# EAGLE board sha2017_rev0_1_0_dev (EAGLE 6.6.0)
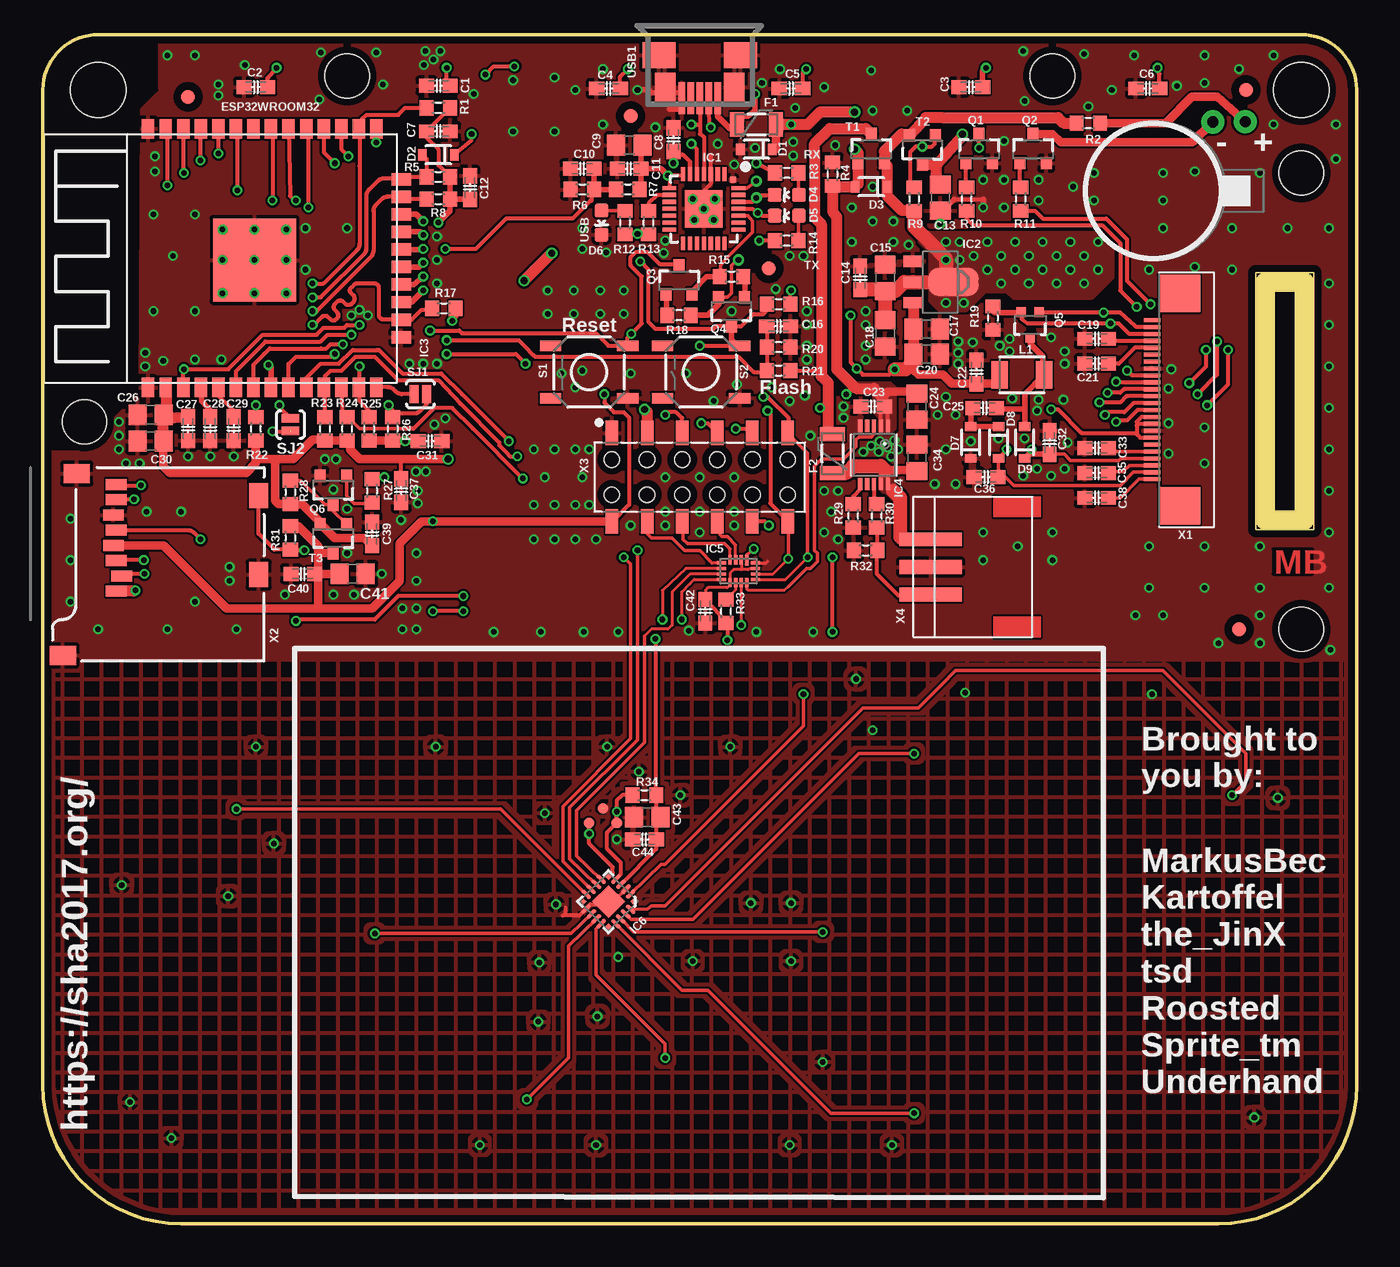
[diagram p5: board, top side]
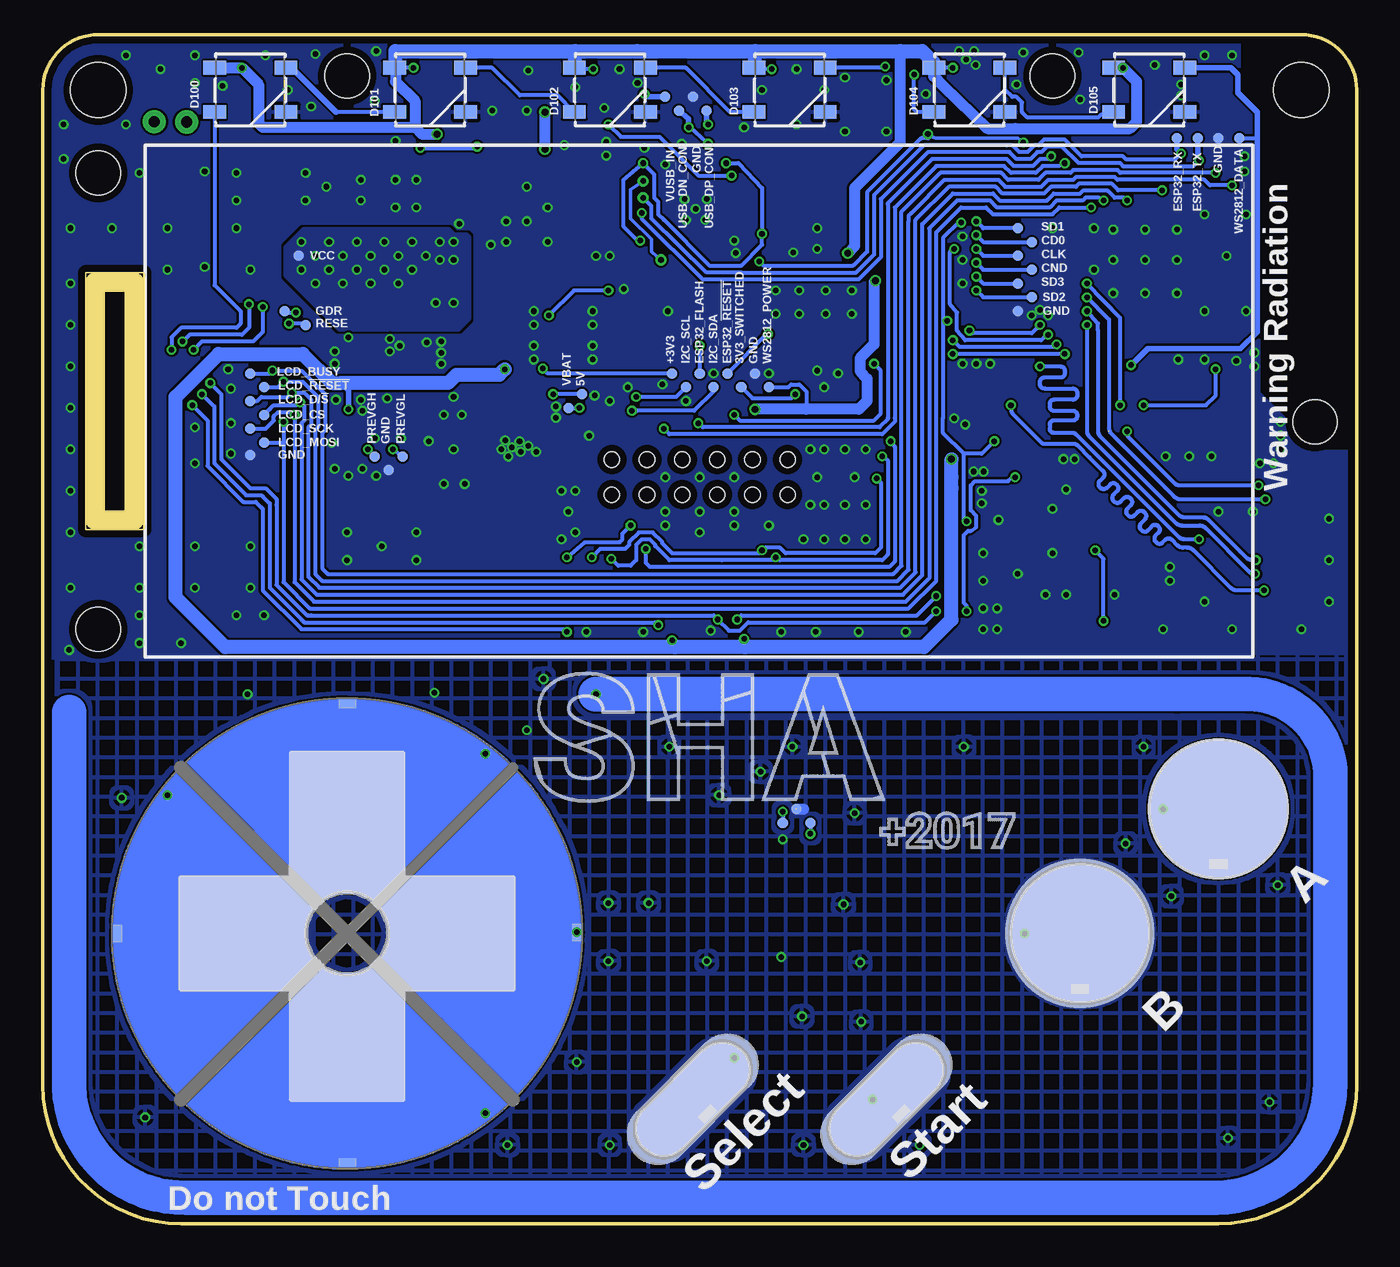
[diagram p6: board, bottom side, seen from below]

Size 95 x 86 mm. Coordinates in mm from the lower left corner, seen from the top.
Outline: 87.7,67.6 87.7,68.8
Outline: 87.7,68.8 91.9,68.8 91.9,50.2 87.7,50.2 87.7,68.8
Outline: 91,86 4,86 arc90 0,82 0,10 arc90 10,0 85,0 arc90 95,10 95,82 arc90 91,86
Copper layers (1*16): Top 0.035mm / dielectric 1.6mm / Bottom 0.035mm
Design rules "Elecrow_2-layer_PCB_eagle_rule *": minimum track width 6mil, minimum drill 12mil, track to track 6mil, track to pad 6mil, pad to pad 6mil, via to via 8mil, smd to smd 0mil, copper to edge 20mil, drill to drill 10mil, minimum pad ring 6mil, minimum via ring 6mil, stop-mask expansion 0mil, vias tented up to drill 100mil, thermal gap 10mil
Net classes: 1 FAT: width 0.2 mm, drill 0.4 mm; 2 GND/3V3: width 0.2 mm, drill 0.4 mm; 3 Touch: width 0.2 mm, clearance 1 mm; 4 touch prox: width 0.2 mm, clearance 1.6 mm
Holes 4 mm at 91,82 4,82
Holes 3.2 mm at 3,58 91,43 91,76 22,83 73,83
tRestrict: area -0.3,56.1 to 8.2,86.1
bRestrict: area -0.3,56.1 to 8.2,86.1
Milling: 4 lines

## Footprints (pad centres in the part's own frame; a part is rotated, then mirrored left to right if it is on the bottom)
VIA = drill 0.4 pad 0.705: P$1 0,0
C0603-DASHES = smd 1.1 x 1: 1 -0.85,0; 2 0.85,0
C0805 = smd 1.3 x 1.5: 1 -0.95,0; 2 0.95,0
SOD-323 = smd 0.63 x 0.83: A 1.15,0; C -1.15,0
LED-0603 = smd 1 x 1: A 0,-0.877; C 0,0.877
WS2812B = smd 1.651 x 1: 1 -2.577,1.6; 2 -2.577,-1.6; 3 2.577,-1.6; 4 2.577,1.6
PTC-1206 = smd 1 x 1.8: 1 -1.4,0; 2 1.4,0
FIDUCIAL_1MM = smd 1 x 1: 1 0,0
MLP28 = smd 1 x 0.3: 1 -2.5,1.5; 2 -2.5,1; 3 -2.5,0.5; 4 -2.5,0; 5 -2.5,-0.5; 6 -2.5,-1; 7 -2.5,-1.5; 15 2.5,-1.5; 16 2.5,-1; 17 2.5,-0.5; 18 2.5,0; 19 2.5,0.5; 20 2.5,1; 21 2.5,1.5 | smd 0.3 x 1: 8 -1.5,-2.5; 9 -1,-2.5; 10 -0.5,-2.5; 11 0,-2.5; 12 0.5,-2.5; 13 1,-2.5; 14 1.5,-2.5; 22 1.5,2.5; 23 1,2.5; 24 0.5,2.5; 25 0,2.5; 26 -0.5,2.5; 27 -1,2.5; 28 -1.5,2.5 | smd 2.7 x 2.7: EXP 0,0 | smd 0.435 x 0.435: M -2.103,2.103
SOT89 = smd 0.8 x 1.4: 1 -1.499,-1.981; 3 1.499,-1.981 | smd 0.813 x 1.397: 2 0,-1.981 | smd 2.032 x 3.65: 2@ 0,0.94
ESP32MOD = smd 6 x 6: 0 9.9,12.3 | smd 1.4 x 0.9: 1 0.68,19.99; 2 0.68,18.72; 3 0.68,17.45; 4 0.68,16.18; 5 0.68,14.91; 6 0.68,13.64; 7 0.68,12.37; 8 0.68,11.1; 9 0.68,9.83; 10 0.68,8.56; 11 0.68,7.29; 12 0.68,6.02; 13 0.68,4.75; 14 0.68,3.48; 25 19.38,3.48; 26 19.38,4.75; 27 19.38,6.02; 28 19.38,7.29; 29 19.38,8.56; 30 19.38,9.83; 31 19.38,11.1; 32 19.38,12.37; 33 19.38,13.64; 34 19.38,14.91; 35 19.38,16.18; 36 19.38,17.45; 37 19.38,18.72; 38 19.38,19.99 | smd 0.9 x 1.4: 15 4.31,1.68; 16 5.58,1.68; 17 6.85,1.68; 18 8.12,1.68; 19 9.39,1.68; 20 10.66,1.68; 21 11.93,1.68; 22 13.2,1.68; 23 14.47,1.68; 24 15.74,1.68
MSOP-10 = smd 0.305 x 0.889: 1 -1,-2.11; 2 -0.5,-2.11; 3 0,-2.11; 4 0.5,-2.11; 5 1,-2.11; 6 1,2.11; 7 0.5,2.11; 8 0,2.11; 9 -0.5,2.11; 10 -1,2.11
UMLP-16 = smd 0.763 x 0.225: 1 -0.768,0.6 | smd 0.663 x 0.225: 2 -0.819,0.2; 3 -0.819,-0.2; 4 -0.819,-0.6; 9 0.819,-0.6; 10 0.819,-0.2; 11 0.819,0.2; 12 0.819,0.6 | smd 0.225 x 0.663: 5 -0.6,-1.218; 6 -0.2,-1.218; 7 0.2,-1.218; 8 0.6,-1.218; 13 0.6,1.218; 14 0.2,1.218; 15 -0.2,1.218; 16 -0.6,1.218
QFN20-3X3MM = smd 0.29 x 0.29: 1 -1.265,1.265; 6 -1.265,-1.265; 11 1.265,-1.265; 16 1.265,1.265 | smd 0.85 x 0.28: 2 -1.524,0.75; 3 -1.524,0.253; 4 -1.529,-0.25; 5 -1.527,-0.774; 12 1.503,-0.77; 13 1.498,-0.245; 14 1.498,0.255; 15 1.495,0.755 | smd 0.28 x 0.85: 7 -0.765,-1.513; 8 -0.265,-1.513; 9 0.263,-1.513; 10 0.763,-1.513; 17 0.758,1.518; 18 0.258,1.518; 19 -0.247,1.518; 20 -0.742,1.518 | smd 1.68 x 1.68: EXT -0.009,0.008
1210 = smd 1.2 x 2: 1 -1.6,0; 2 1.6,0
SOT23-3 = smd 0.8 x 0.9: 1 -0.95,-1; 2 0.95,-1; 3 0,1.1
SOT323 = smd 0.7 x 0.7: 1 -0.65,-0.925; 2 0.65,-0.925; 3 0,0.925
R0603-DASHES = smd 1 x 1.1: 1 -0.85,0; 2 0.85,0
TACTILE-SWITCH-SMD = smd 1.524 x 0.762: 1 -2.794,1.905; 2 2.794,1.905; 3 -2.794,-1.905; 4 2.794,-1.905
PAD-JUMPER-2-NO_YES_SILK = smd 0.635 x 1.27: 1 -0.45,0; 2 0.45,0
TOUCH_SELECT = smd 1.27 x 0.635: P$1 0,-1.5
TOUCH_CROSS = smd 1.27 x 0.635: D 0.03,-16.57; UP 0.02,16.6 | smd 0.635 x 1.27: L -16.59,-0.02; R 16.6,0.06
TOUCH_BUTTON = smd 1.27 x 0.635: P$1 0,-4
PAD.03X.03 = smd 0.762 x 0.762: P$1 0,0
VIBE-MOTOR-10MM = drill 0.8 pad 1.676: + 5,-6.44; - 4.98,-4.11
MOLEX-47364-0001 = smd 2.3 x 0.45: 1 3.1,1.3; 2 3.1,0.65; 3 3.1,0; 4 3.1,-0.65; 5 3.1,-1.3 | smd 1.9 x 2.375: GND1 0,2.95; GND4 0,-2.95 | smd 2.1 x 1.475: GND2 2.3,2.5; GND3 2.3,-2.5
68712414022 = smd 0.3 x 1.2: 1 -5.75,0.6; 2 -5.25,0.6; 3 -4.75,0.6; 4 -4.25,0.6; 5 -3.75,0.6; 6 -3.25,0.6; 7 -2.75,0.6; 8 -2.25,0.6; 9 -1.75,0.6; 10 -1.25,0.6; 11 -0.75,0.6; 12 -0.25,0.6; 13 0.25,0.6; 14 0.75,0.6; 15 1.25,0.6; 16 1.75,0.6; 17 2.25,0.6; 18 2.75,0.6; 19 3.25,0.6; 20 3.75,0.6; 21 4.25,0.6; 22 4.75,0.6; 23 5.25,0.6; 24 5.75,0.6 | smd 2.7 x 3: 25 -7.68,-1.38; 26 7.68,-1.38
MICRO-SD-SOCKET-PP = smd 0.8 x 1.5: 1 -8.94,10.7; 2 -7.84,10.3; 3 -6.74,10.7; 4 -5.64,10.9; 5 -4.54,10.7; 6 -3.44,10.9; 7 -2.34,10.7; 8 -1.24,10.7 | smd 1.8 x 1.4: CD1 -2.05,0.4; CD2 -7.75,0.4 | smd 1.4 x 1.9: GND1 -13.6,14.55; GND3 -0.45,13.55
610X12243021 = smd 0.9 x 1.8: 1 -6.35,3.2; 2 -3.81,3.2; 3 -1.27,3.2; 4 1.27,3.2; 5 3.81,3.2; 6 6.35,3.2; 7 6.35,-3.2; 8 3.81,-3.2; 9 1.27,-3.2; 10 -1.27,-3.2; 11 -3.81,-3.2; 12 -6.35,-3.2 | hole 1.1: -6.35,1.27; -3.81,1.27; -3.81,-1.27; -6.35,-1.27; -1.27,1.27; -1.27,-1.27; 1.27,1.27; 1.27,-1.27; 3.81,1.27; 3.81,-1.27; 6.35,1.27; 6.35,-1.27
JST-PH3 = smd 1 x 4.5: 1 2,0; 2 0,0; 3 -2,0

## Placement (x,y rotation side)
$$U$1  VIA  [VIA]  46.1,31 0 top
$$U$2  VIA  [VIA]  89.3,30.8 0 top
$$U$3  VIA  [VIA]  36.3,29.7 0 top
$$U$4  VIA  [VIA]  16.7,27.5 0 top
$$U$5  VIA  [VIA]  5.7,24.5 0 top
$$U$6  VIA  [VIA]  13.4,23.7 0 top
$$U$7  VIA  [VIA]  51.2,23.2 0 top
$$U$8  VIA  [VIA]  54.1,23.2 0 top
$$U$9  VIA  [VIA]  37.1,23.1 0 top
C1  100n  [C0603-DASHES]  28.6,82.3 0 top
C2  100n  [C0603-DASHES]  15.4,82.2 0 top
C3  100n  [C0603-DASHES]  67.1,82.2 0 top
C4  100n  [C0603-DASHES]  40.9,82.1 0 top
C5  100n  [C0603-DASHES]  54.1,82.1 0 top
C6  100n  [C0603-DASHES]  79.9,82.1 0 top
C7  100n  [C0603-DASHES]  28.6,79 0 top
C8  100n  [C0603-DASHES]  45.6,78.4 90 top
C9  4u7/16V  [C0805]  42.4,78 180 top
C10  100n  [C0603-DASHES]  39,76.3 180 top
C11  100n  [C0603-DASHES]  42.4,76.3 180 top
C12  100n  [C0603-DASHES]  30.88,74.93 90 top
C13  4u7/16V  [C0805]  64.9,74.2 270 top
C14  100n  [C0603-DASHES]  59.1,68.4 90 top
C15  4u7/16V  [C0805]  60.9,68.4 90 top
C16  100n  [C0603-DASHES]  53.2,64.9 0 top
C17  4u7/16V  [C0805]  63.9,64.7 0 top
C18  4u7/16V  [C0805]  60.9,64.4 270 top
C19  1u  [C0603-DASHES]  76.2,64 0 top
C20  4u7/16V  [C0805]  63.9,62.9 0 top
C21  1u  [C0603-DASHES]  76.2,62.2 0 top
C22  100n  [C0603-DASHES]  67.5,61.6 90 top
C23  100n  [C0603-DASHES]  60,59.1 0 top
C24  4u7/16V  [C0805]  63.2,59.1 270 top
C25  1u  [C0603-DASHES]  68.1,59 0 top
C26  4u7/16V  [C0805]  7.8,58.5 180 top
C27  100n  [C0603-DASHES]  10.5,57.5 270 top
C28  100n  [C0603-DASHES]  12.1,57.5 90 top
C29  100n  [C0603-DASHES]  13.8,57.5 90 top
C30  4u7/16V  [C0805]  7.8,56.6 180 top
C31  100n  [C0603-DASHES]  28,56.6 0 top
C32  1u  [C0603-DASHES]  72.8,56.5 270 top
C33  1u  [C0603-DASHES]  76.2,56.1 0 top
C34  4u7/16V  [C0805]  63.2,55.4 90 top
C35  1u  [C0603-DASHES]  76.2,54.3 0 top
C36  1u  [C0603-DASHES]  68.2,54 0 top
C37  100n  [C0603-DASHES]  25.91,53.03 270 top
C38  1u  [C0603-DASHES]  76.2,52.5 0 top
C39  1u  [C0603-DASHES]  23.8,49.9 90 top
C40  100n  [C0603-DASHES]  18.8,47 180 top
C41  4u7/16V  [C0805]  22.4,47 0 top
C42  100n  [C0603-DASHES]  47.9,44.3 270 top
C43  4u7/16V  [C0805]  43.7,29.4 180 top
C44  100n  [C0603-DASHES]  43.5,27.8 180 top
D1  SD05-7  [SOD-323]  51.6,77.7 180 top
D2  NSVR0320MW2T1G  [SOD-323]  28.6,77.3 180 top
D3  NSVR0320MW2T1G  [SOD-323]  59.9,75 180 top
D4  Yellow  [LED-0603]  53.8,74.4 90 top
D5  RED  [LED-0603]  53.8,72.9 90 top
D6  green  [LED-0603]  40.4,72.4 180 top
D7  NSVR0320MW2T1G  [SOD-323]  67.1,56.5 90 top
D8  NSVR0320MW2T1G  [SOD-323]  69.1,56.5 270 top
D9  NSVR0320MW2T1G  [SOD-323]  71,56.5 90 top
D100  SK6812  [WS2812B]  80,82 0 bottom
D101  SK6812  [WS2812B]  67,82 0 bottom
D102  SK6812  [WS2812B]  54,82 0 bottom
D103  SK6812  [WS2812B]  41,82 0 bottom
D104  SK6812  [WS2812B]  28,82 0 bottom
D105  SK6812  [WS2812B]  15,82 0 bottom
F1  900mA  [PTC-1206]  51.6,79.5 0 top
F2  900mA  [PTC-1206]  57.1,55.7 90 top
FD1  FIDUCIAL  [FIDUCIAL_1MM]  87,82 0 top
FD2  FIDUCIAL  [FIDUCIAL_1MM]  10.5,81.5 0 top
FD3  FIDUCIAL  [FIDUCIAL_1MM]  42.5,80.1 0 top
FD4  FIDUCIAL  [FIDUCIAL_1MM]  52.5,69.1 0 top
FD5  FIDUCIAL  [FIDUCIAL_1MM]  86.5,43 0 top
IC1  CP210X_USB_UART  [MLP28]  47.8,73.4 270 top
IC2  AP7215  [SOT89]  64.9,68.1 270 top
IC3  ESP32WROOM32  [ESP32MOD]  27.6,59.8 90 top
IC4  MCP73833  [MSOP-10]  60.1,55.6 180 top
IC5  FXL6408  [UMLP-16]  50.3,47.2 270 top
IC6  CPT112  [QFN20-3X3MM]  40.9,23.3 225 top
L1  22µ  [1210]  70.8,61.4 0 top
Q1  MMBT2222A  [SOT23-3]  67.7,77.7 0 top
Q2  MMBT2222A  [SOT23-3]  71.6,77.7 0 top
Q3  MMBT2222A  [SOT23-3]  46,68.2 0 top
Q4  MMBT2222A  [SOT23-3]  49.8,66 180 top
Q5  SI1304 BDL  [SOT323]  71.4,65 180 top
Q6  MMBT2222A  [SOT23-3]  21,53.1 180 top
R1  10k  [R0603-DASHES]  28.6,80.7 0 top
R2  27R  [R0603-DASHES]  75.6,79.6 180 top
R3  1k  [R0603-DASHES]  53.8,76 180 top
R4  10k  [R0603-DASHES]  57.1,75.9 270 top
R5  10k  [R0603-DASHES]  28.6,75.7 0 top
R6  100k  [R0603-DASHES]  39,74.8 0 top
R7  220k  [R0603-DASHES]  42.3,74.8 0 top
R8  10k  [R0603-DASHES]  28.6,74.1 0 top
R9  10k  [R0603-DASHES]  63,74.1 270 top
R10  10k  [R0603-DASHES]  66.8,74.1 90 top
R11  10k  [R0603-DASHES]  70.7,74.1 270 top
R12  1k  [R0603-DASHES]  42.1,72.4 270 top
R13  10k  [R0603-DASHES]  43.8,72.4 90 top
R14  1k  [R0603-DASHES]  53.8,71.1 180 top
R15  10k  [R0603-DASHES]  49.8,68.5 0 top
R16  10k  [R0603-DASHES]  53.2,66.5 0 top
R17  10k  [R0603-DASHES]  29,66.2 0 top
R18  10k  [R0603-DASHES]  46,65.7 180 top
R19  5R  [R0603-DASHES]  68.7,65.5 270 top
R20  100k  [R0603-DASHES]  53.2,63.4 180 top
R21  220k  [R0603-DASHES]  53.2,61.7 0 top
R22  10k  [R0603-DASHES]  15.4,57.5 90 top
R23  4k7  [R0603-DASHES]  20.4,57.5 90 top
R24  4k7  [R0603-DASHES]  22,57.5 90 top
R25  10k  [R0603-DASHES]  23.6,57.5 270 top
R26  10k  [R0603-DASHES]  25.3,57.5 270 top
R27  10k  [R0603-DASHES]  23.8,53 270 top
R28  10k  [R0603-DASHES]  17.9,52.9 270 top
R29  2.2k  [R0603-DASHES]  58.6,51.2 90 top
R30  1k  [R0603-DASHES]  60.3,51.2 90 top
R31  100k  [R0603-DASHES]  17.9,49.6 270 top
R32  150k  [R0603-DASHES]  59.5,48.7 0 top
R33  10k  [R0603-DASHES]  49.4,44.3 90 top
R34  1k  [R0603-DASHES]  43.5,31 0 top
S1  SWITCH-MOMENTARY-2SMD  [TACTILE-SWITCH-SMD]  39.5,61.6 180 top
S2  SWITCH-MOMENTARY-2SMD  [TACTILE-SWITCH-SMD]  47.6,61.6 180 top
SJ1  JUMPER-PAD-2-NOYES_SILK  [PAD-JUMPER-2-NO_YES_SILK]  27.3,60 0 top
SJ2  JUMPER-PAD-2-NOYES_SILK  [PAD-JUMPER-2-NO_YES_SILK]  17.9,57.8 270 top
T1  [SOT23-3]  59.9,77.7 0 top
T2  [SOT23-3]  63.6,77.7 180 top
T3  [SOT23-3]  21,49.6 180 top
TB100  TOUCHSELECT  [TOUCH_SELECT]  48,9 45 bottom
TB101  TOUCHSELECT  [TOUCH_SELECT]  34,9 45 bottom
TB102  TOUCH_CROSS  [TOUCH_CROSS]  73,21 0 bottom
TB103  TOUCHROUND  [TOUCH_BUTTON]  20,21 0 bottom
TB104  TOUCHROUND  [TOUCH_BUTTON]  10,30 0 bottom
TP1  TEST-POINT3  [PAD.03X.03]  40.49,30.04 0 top
TP2  TEST-POINT3  [PAD.03X.03]  39.5,29 0 top
TP3  TEST-POINT3  [PAD.03X.03]  41.5,29 0 top
TP100  TEST-POINT3  [PAD.03X.03]  41.5,29 0 bottom
TP101  TEST-POINT3  [PAD.03X.03]  39.5,29 0 bottom
TP102  TEST-POINT3  [PAD.03X.03]  40.5,30 0 bottom
TP103  TEST-POINT3  [PAD.03X.03]  70,54.5 0 bottom
TP104  TEST-POINT3  [PAD.03X.03]  71,55.5 0 bottom
TP105  TEST-POINT3  [PAD.03X.03]  69,55.5 0 bottom
TP106  TEST-POINT3  [PAD.03X.03]  80,55.6 0 bottom
TP107  TEST-POINT3  [PAD.03X.03]  79,56.5 0 bottom
TP108  TEST-POINT3  [PAD.03X.03]  80,57.5 0 bottom
TP109  TEST-POINT3  [PAD.03X.03]  79,58.5 0 bottom
TP110  TEST-POINT3  [PAD.03X.03]  57,59 0 bottom
TP111  TEST-POINT3  [PAD.03X.03]  80,59.5 0 bottom
TP112  TEST-POINT3  [PAD.03X.03]  56,60 0 bottom
TP113  TEST-POINT3  [PAD.03X.03]  79,60.5 0 bottom
TP114  TEST-POINT3  [PAD.03X.03]  48.5,60.5 0 bottom
TP115  TEST-POINT3  [PAD.03X.03]  46.5,60.5 0 bottom
TP116  TEST-POINT3  [PAD.03X.03]  44.5,60.5 0 bottom
TP117  TEST-POINT3  [PAD.03X.03]  42.5,60.5 0 bottom
TP118  TEST-POINT3  [PAD.03X.03]  80,61.5 0 bottom
TP119  TEST-POINT3  [PAD.03X.03]  49.5,61.5 0 bottom
TP120  TEST-POINT3  [PAD.03X.03]  47.5,61.5 0 bottom
TP121  TEST-POINT3  [PAD.03X.03]  45.5,61.5 0 bottom
TP122  TEST-POINT3  [PAD.03X.03]  43.5,61.5 0 bottom
TP123  TEST-POINT3  [PAD.03X.03]  76,65 0 bottom
TP124  TEST-POINT3  [PAD.03X.03]  77.5,66 0 bottom
TP125  TEST-POINT3  [PAD.03X.03]  24.5,66 0 bottom
TP126  TEST-POINT3  [PAD.03X.03]  23.5,67 0 bottom
TP127  TEST-POINT3  [PAD.03X.03]  24.5,68 0 bottom
TP128  TEST-POINT3  [PAD.03X.03]  23.5,69 0 bottom
TP129  TEST-POINT3  [PAD.03X.03]  76.5,70 0 bottom
TP130  TEST-POINT3  [PAD.03X.03]  24.5,70 0 bottom
TP131  TEST-POINT3  [PAD.03X.03]  23.5,71 0 bottom
TP132  TEST-POINT3  [PAD.03X.03]  24.5,72 0 bottom
TP133  TEST-POINT3  [PAD.03X.03]  13,78.5 0 bottom
TP134  TEST-POINT3  [PAD.03X.03]  11.5,78.5 0 bottom
TP135  TEST-POINT3  [PAD.03X.03]  10,78.5 0 bottom
TP136  TEST-POINT3  [PAD.03X.03]  8.5,78.5 0 bottom
TP137  TEST-POINT3  [PAD.03X.03]  49,80.5 0 bottom
TP138  TEST-POINT3  [PAD.03X.03]  47,80.5 0 bottom
TP139  TEST-POINT3  [PAD.03X.03]  50,81.5 0 bottom
TP140  TEST-POINT3  [PAD.03X.03]  48,81.5 0 bottom
U$1  MOTOR10MM  [VIBE-MOTOR-10MM]  80.5,74.7 90 top
U$2  VIA  [VIA]  58.8,39.4 0 top
U$3  VIA  [VIA]  15.4,34.5 0 top
U$4  VIA  [VIA]  28.4,34.5 0 top
U$5  VIA  [VIA]  40.8,34.5 0 top
U$6  VIA  [VIA]  49.7,34.5 0 top
U$10  VIA  [VIA]  47,19 0 top
U$11  VIA  [VIA]  54.1,19 0 top
U$12  VIA  [VIA]  35.9,18.9 0 top
U$13  VIA  [VIA]  40.1,15 0 top
U$14  VIA  [VIA]  35.83,14.61 0 top
U$15  VIA  [VIA]  56.4,11.7 0 top
U$16  VIA  [VIA]  6.3,8.8 0 top
U$17  VIA  [VIA]  87.6,7.7 0 top
U$18  VIA  [VIA]  9.3,6.2 0 top
U$19  VIA  [VIA]  31.6,5.7 0 top
U$20  VIA  [VIA]  40,5.7 0 top
U$21  VIA  [VIA]  54,5.7 0 top
U$22  VIA  [VIA]  61.4,5.7 0 top
U$23  VIA  [VIA]  43.1,32.7 0 top
USB1  MOLEX-47346-0001  [MOLEX-47364-0001]  47.5,84.5 270 top
X1  [68712414022]  80.8,59.6 90 top
X2  2908-05WB-MG  [MICRO-SD-SOCKET-PP]  16,54.7 90 top
X3  [610X12243021]  47.5,54 0 top
X4  JST-PH3  [JST-PH3]  64.2,47.5 270 top

## Tracks (layer width: path | path; a pad name or v marks a point on that pad's centre or on a via)
3V3_SWITCHED  (via drill 0.4)
  Top 0.305: v40.6,60 40.6,59.4 41.3,58.7 42,58.7 42.4,58.3 42.4,52 41.2,50.8 X3.12 | 29.45,76.05 R5.2 28.6,76.55 28.6,77.7 27.75,78.55 C7.1 R1.2 | 28.7,72.5 v28.6,72.4 | v29.6,65.3 29.9,65.6 29.9,66.15 R17.2 | 27.4,50.8 v28.2,50.8 | 26.85,56.65 C31.1 v26.2,56.6
  Top 0.406: C12.1 29.45,74.08 R8.2 | 28.7,72.5 29.45,73.25 R8.2 | R8.2 R5.2
  Top 0.61: C40.1 19.75,47 | 19.75,47 19.9,47.25 | C40.1 19.9,46.75 19.9,44.5 | 19.9,44.5 13.3,44.5 8.74,49.06 X2.4 | X3.12 v28.2,50.8 | v28.2,50.8 27.4,50.8 | 27.4,50.8 25.8,49.2 25.8,46.5 23.8,44.5 19.9,44.5 | 19.75,47 C41.1 | R25.2 R26.2 26.85,56.65 | R31.1 18.45,50.45 19.9,49 19.9,48.7 | 19.9,48.7 19.9,47.25 | 19.9,47.25 C40.1 | T3.3 20.1,48.5 19.9,48.7 | 27.4,50.8 v28.2,50.8
  Bottom 0.305: TP116.P$1 43.7,59.7 40.9,59.7 v40.6,60 | v28.6,72.4 28.8,72.4 29.9,71.3 29.9,65.6 | 29.9,65.6 29.9,58.3 29.9,57.2 28.4,55.7 | 29.9,65.6 v29.6,65.3 | v28.2,50.8 28.4,51 28.4,55.7 | v26.2,56.6 27.1,55.7 28.4,55.7
+3V3  (via drill 0.4, 0.5)
  Top 0.2: IC5.15 51.22,47.4 51,47.31 50.5,47.31 | IC5.2 50.5,47.31 | 50.5,47.31 49.95,47.31 49.7,47.06 IC5.9 49.7,46.2 49.5,46 48.1,46 47.9,45.8 C42.1
  Top 0.305: X1.10 79.45,58.35 79.1,58 79.1,57.7 | 79.1,57.7 79.1,57.1 | 79.1,57.1 79.35,56.85 X1.7 | 79.1,57.7 arc-90 79.25,57.85 X1.9 | v72.9,58.9 73.4,58.9 75.1,57.2 79,57.2 79.1,57.1 | R16.2 54.05,67.45 v54.1,67.5 | v58.4,65.7 58.4,62.3 v58.85,61.85 59.3,61.4 61.2,61.4 v61.6,61.8 | C42.1 47.9,45.1 49.4,43.6 R33.1 49.5,43.35 v49.5,42.2 | 44.35,29.2 R34.2 44.35,42.25 v44.3,42.3 | 44.35,29.2 C44.1 44.35,27.1 IC6.4 | C43.1 arc-45 44.41,29.2 44.35,29.2 | C37.1 25.9,53.9 25.9,55.3
  Top 0.61: L1.1 69.3,61.3 69.3,60.9 69.15,60.75 C22.1 65.75,60.75 65.1,61.4 63.3,61.4 63,61.7 63,62.4 63,62.85 C20.1 | 16.8,55.3 16.8,52.3 17.05,52.05 R28.2 17.95,52 18.8,52 20.05,50.75 T3.2 | T3.2 20.05,50.45 | C39.1 23.25,49.6 21.1,49.6 20.1,50.6 T3.2 | 8.7,56.7 8.7,54.8 9.2,54.3 14.7,54.3 15.4,55 15.4,55.3 | 15.4,55.3 R22.1 | 16.8,55.3 16.75,55.3 15.4,55.3 | v29.3,55.3 25.9,55.3 22.9,55.3 22.2,56 22.2,56.45 R24.1 R23.1 20.35,56.7 19.5,56.7 18.1,55.3 16.8,55.3
  Top 0.813: IC3.2 8.9,60.4 8.9,58.5 | 8.9,58.5 C26.1 | 8.9,58.5 8.78,58.22 8.62,58.28 | 8.62,58.28 C27.1 | C30.1 8.7,56.7 8.7,57.9 9.2,58.4 8.62,58.28 | IC2.3 62.95,66.57 C17.1 C20.1
  Top 1.016: v61.6,61.8 62.4,61.8 63,62.4
  Bottom 0.305: v54.1,67.5 56.6,67.5 v58.4,65.7 | v49.5,42.2 49.3,42 49.3,41.7 | v44.3,42.3 44.3,41.8 44.2,41.7 | TP119.P$1 58.5,61.5 v58.85,61.85
  Bottom 0.406: v72.9,58.9 72.9,60.3 73.4,60.8
  Bottom 0.61: 29.3,54 v29.3,55.3 29.3,54 | 29.3,54 29.3,53.2
  Bottom 1.016: v61.6,61.8 62,61.4 65.1,61.4 65.7,60.8 73.4,60.8 74.1,60.8 76.2,62.9 82.3,62.9 85.4,59.8 85.4,45.3 81.8,41.7 49.3,41.7 44.2,41.7 31.3,41.7 29.3,43.7 29.3,53.2 29.3,54 v29.3,55.3
+5V  (via drill 0.4, 0.4 pad 0.61, 0.5)
  Top 0.305: 45.4,75.8 v45.2,75.8 46.2,75.8 | 45.4,75.8 45.3,75.7 IC1.8 | 46.2,75.8 IC1.7 46.2,75.8 | 46.2,75.8 45.4,75.8 | IC4.2 60.6,58.9 C23.2 61.1,58.6 IC4.1 | v58.1,60 58.55,60.65
  Top 0.406: 43.3,77.6 C9.1 43.25,77.9 C11.1 | C11.1 43.25,74.9 R7.2 | C11.1 44.7,76.3 v45.2,75.8
  Top 0.61: 60.7,59.8 61.1,60.2 63.05,60.2 C24.1 | D1.C 53,77.9 F1.2 53,77.7 D1.C
  Top 0.813: R4.2 57.1,75 | 57.1,75 D3.A 58.95,75.2 T1.1 58.95,77.45 v58.7,77.7 | v58.7,80.4 56.2,80.4 55.3,79.5 v54.1,79.5 | v54.1,79.5 F1.2 | v54.1,79.5 53.1,79.5 53,79.6 | 57.1,75 57.1,74.3 57.1,73.7 57.1,73.2 57.4,72.8 57.4,62 57.4,61.9 57.4,61.8 58.55,60.65 58.8,60.4 60.1,60.4 60.7,59.8 C23.2
  Bottom 0.305: v54.1,79.5 53.2,78.6 50.4,78.6 47.6,75.8 v45.2,75.8 | TP112.P$1 v58.1,60
  Bottom 0.813: v58.7,77.7 58.7,79.4 v58.7,80.4
  pour Top (no thermals): 60.5,58.3 60.5,57.3 61.4,57.3 61.6,57.5 61.6,60.5 61.3,60.8 58.7,60.8 58.7,60.5 58.8,60.4 59.6,60.4 60.1,59.9 60.1,58.7
CD0  (via drill 0.4)
  Top 0.406: IC3.21 27.27,71.73 v27.5,71.5
  Bottom 0.305: v27.5,71.5 27,71 TP131.P$1
CHRG_STAT
  Top 0.2: 53.9,46.1 53.6,45.8 51,45.8 50.9,45.9 IC5.12
  Top 0.254: IC4.3 60.1,57.1 59.9,56.9 59,56.9 58.8,56.7 58.8,56.4 58.8,56.2 57.9,55.3 57.8,55.3 56.6,55.3 56.3,55.3 55.8,54.8 55.8,54.5 55.8,48.7 56,48.5 56,47.9 55.5,47.4 55.2,47.4 53.9,46.1
CLK  (via drill 0.4)
  Top 0.406: IC3.20 27.46,70.46 v27.5,70.5
  Bottom 0.305: v27.5,70.5 27,70 TP130.P$1
CND  (via drill 0.4)
  Top 0.406: IC3.19 27.19,69.19 v27.5,69.5
  Bottom 0.305: v27.5,69.5 27,69 TP128.P$1
ESP32_!RESET  (via drill 0.4)
  Top 0.305: R22.2 v15.4,59.2 | 10.2,60.53 IC3.3 10.15,61.75 v10.2,61.8 13.4,61.8 15.9,64.3 19.8,64.3 20.3,64.8 21.8,64.8 22,65 v22.9,65 | v28,64.6 30.1,64.6 30.3,64.4 40,64.4 40.9,63.5 S1.3 42.29,64.09 v42.55,64.35 | v42.55,64.35 42.9,64.7 | 42.9,64.7 43.3,65.1 43.3,68.5 42.5,69.3 42.5,69.9 42.9,70.3 43.7,70.3 44.6,69.4 45.9,69.4 Q3.3 | v42.55,64.35 42.9,64.7
  Bottom 0.305: v15.4,59.2 10.9,59.2 10.2,59.9 v10.2,61.8 | v22.9,65 23.5,64.4 27.8,64.4 v28,64.6 | TP121.P$1 42.55,64.45 v42.55,64.35
ESP32_FLASH  (via drill 0.4)
  Top 0.254: 24.2,79.1 24.1,79 v24.1,78.2
  Top 0.305: R16.1 52.4,66.75 52.4,66.1 52.1,65.8 51.4,65.8 50.5,64.9 Q4.3 48.7,64.9 48.5,64.7 44.3,64.7 43.8,65.2 43.8,69 v43.2,69.6 | 24.2,79.1 IC3.25 | v47.5,63.5 S2.3 | D2.C 31,78.35 v31,78.8
  Top 0.406: Q4.3 49.8,63.9 50.2,63.51 S2.3
  Bottom 0.254: v24.1,78.2 24.5,78.5 30.2,78.5 arc41 v31,78.8
  Bottom 0.305: v43.2,69.6 42.9,69.3 36.4,69.3 35.4,70.3 35.4,74.6 31.5,78.5 31,78.5 v31,78.8 | TP120.P$1 v47.5,63.5
ESP32_RX  (via drill 0.4, 0.4 pad 0.81)
  Top 0.254: IC1.26 51.3,73.9 v51.6,74.2
  Top 0.305: IC1.26 51.3,73.9 v51.6,74.2 51.7,74.4 D4.C | v12.7,77.4 IC3.34
  Bottom 0.305: v51.6,74.2 51,73.6 51,72.7 47,68.8 44.5,68.8 36.2,68.8 34.9,70.1 34.9,74.4 31.3,78 25.3,78 24.9,78 24.4,77.5 23.8,77.5 23.3,78 23,78 22.6,78.4 21.1,78.4 21,78.3 19.9,77.2 16.9,77.2 16.7,77 13.1,77 v12.7,77.4
  Bottom 0.406: TP133.P$1 13,77.7 v12.7,77.4
ESP32_TX  (via drill 0.4, 0.4 pad 0.41)
  Top 0.254: IC1.25 51.3,73.4
  Top 0.305: IC1.25 51.3,73.4 | 51.3,73.4 v51.7,73.1 | v51.7,73.1 52,72.9 D5.C | 51.3,73.4 v51.7,73.1 | v11.4,76.9 11.4,79.16 IC3.35
  Bottom 0.305: v51.7,73.1 51.7,72.7 47.3,68.3 44.7,68.3 36,68.3 34.4,69.9 34.4,74.1 31,77.5 25.2,77.5 25.1,77.5 24.6,77 23.6,77 23.1,77.5 22.8,77.5 22.4,77.9 21.3,77.9 20.1,76.7 17.1,76.7 16.9,76.5 11.8,76.5 v11.4,76.9
  Bottom 0.406: TP134.P$1 11.5,77 v11.4,76.9
EXTIO-0  (via drill 0.4)
  Top 0.305: X3.3 46.23,58.27 45.8,58.7 45.2,58.7 v45,58.5 | 17.7,60.55 IC3.9 17.77,62.17 18.3,62.7 20.9,62.7 v21.1,62.9 | v29.2,62.9 34.2,62.9 v34.9,62.2
  Bottom 0.305: v45,58.5 44.6,58.1 34.9,58.1 34.4,58.6 34.4,61.7 v34.9,62.2 | v21.1,62.9 v29.2,62.9
EXTIO-1  (via drill 0.4)
  Top 0.305: IC3.27 21.58,77.72 v22.1,77.2 | v47.6,57.9 48.07,57.9 X3.4
  Bottom 0.305: v22.1,77.2 22.3,77 22.9,77 23.4,76.5 24.8,76.5 25.3,77 30.7,77 33.9,73.8 33.9,73.7 33.9,58.3 33.9,58.2 34.5,57.6 47.3,57.6 v47.6,57.9
EXTIO-2  (via drill 0.4)
  Top 0.305: IC3.28 20.31,77.49 v21.1,76.7 | v50.1,57.5 51.01,57.5 X3.5
  Bottom 0.305: v21.1,76.7 21.2,76.7 21.5,76.5 22.7,76.5 23.2,76 25,76 25.5,76.5 30.4,76.5 33.4,73.5 33.4,58.3 33.4,58 34.3,57.1 49.7,57.1 v50.1,57.5
EXTIO-3
  Top 0.2: IC5.3 50.1,49.1
  Top 0.254: X3.9 48.97,50.6 48.97,49.83 49.1,49.7 49.5,49.7 50.1,49.1
EXTIO-4
  Top 0.2: IC5.4 49.7,48.8
  Top 0.254: 49.7,48.8 49.3,49.2 46.6,49.2 46.3,49.5 46.3,50.73 X3.10
EXTIO-5
  Top 0.2: IC5.5 48.4,47.8
  Top 0.254: 48.4,47.8 47.5,48.7 46.4,48.7 45.5,49.6 44,49.6 43.7,49.9 X3.11
GDR  (via drill 0.4)
  Top 0.305: v76.7,65.9 77.9,65.9 79,64.9 79.05,64.85 X1.23 | v76.7,65.9 76.4,65.9 | 76.4,65.9 72.1,65.9 Q5.1 | v76.7,65.9 76.4,65.9
  Bottom 0.305: TP124.P$1 77.4,65.9 v76.7,65.9
GND  (via drill 0.4, 0.4 pad 0.61)  (1 unrouted)
  Top 0.2: IC5.16 52.3,47.8 52.4,47.9
  Top 0.254: 37.6,22.3 37.8,22.5 37.8,22.9 | IC6.3 41.52,23.59
  Top 0.305: 48.3,77.3 IC1.3 48.3,75.8 | 41.52,23.59 40.9,23.6 40.4,23.1 39.6,23.1 IC6.12 38.8,22.3 37.6,22.3 | 48.3,75.7 48.3,75.2 47.8,74.7 | 65.9,74.1 68,74.1
  Top 0.406: v43,82 43.8,82 44,81.8 46.2,81.8 46.2,80.6 45.3,80.6 | C13.2 65.05,73.25 65.9,74.1 | 68,74.1 v68,73.5
  Bottom 0.813: TP102.P$1 40,30
  other vias: 72.9,54.1 70.9,54.1 53,67.6 44.9,70.2 45,71.1 71.9,54.6 69.9,63.1 73.9,63.1 72.9,64.1 49.8,66 50,76.6 51.5,77.8 47,74.1 48.6,74.1 48.5,72.6 47.1,72.6 47.8,73.4 48.8,78.1 44.3,79.3 69.9,64 69.2,63.5 66.2,63.8 73.8,59.6 74.1,56.5 71,56.8 67.1,56.6 69.1,56.8 73.9,54.6 73.9,62.2 41.5,27.8 60,35.7 80.2,38.3 66.7,38.4 81.6,61.8 57.3,78 62.6,70.8 10.5,55.5 12.1,55.5 13.8,55.5 72,59.6 70.1,59.7 71.9,58.8 66.2,62.2 66.2,63 57.9,58.3 9,84.5 11,84.5 12.7,82.4 12.7,81.6 20.1,84.7 20,81.3 24.1,84.7 24.6,82.4 37,82.9 40.5,83.5 38.5,82 37,79 40.5,79.5 60,80.5 78.9,84.5 84,84.5 82,82.3 84,82.5 86.5,83.5 89,84.5 89,79.5 93.5,79.5 93.5,77 60,75 58.5,73.5 61.5,72.5 60,72.5 58.5,71 61.5,71 68,75.5 69.5,75.5 69.5,73.5 72,75.5 72,74 74.5,75 59.5,63.5 59.5,62.5 59.5,66 59.5,65 66,58.5 64.7,58.5 65.3,59.8 65.3,56 64.5,53.5 66,53.5 59.89,56.26 60.45,55.82 61.08,56.15 57.5,53 56.5,53 57,51.5 56.5,50 57.5,49.5 50,51.5 47.5,51.5 47.5,50 50,50.5 45,51.5 45,50.5 42.5,50.5 45,54 47.5,54 50,54 55.5,57 55.1,59.9 54,59.5 52.7,60.5 48.5,59.5 50.2,60.7 46.5,61.5 42.5,61.5 39,61.7 37.5,61.5 38.5,60.5 36.5,67.5 42,67.5 36.5,65.8 42,65.8 39,72 39,70.5 54,70 55,70 28.3,57.8 26.5,62.2 27.5,62.2 28.5,62.2 28.5,68 22.3,65.7 23.5,65.7 25.9,50.9 27.1,53 22,51.7 21,53.1 13.5,47.5 10,51.5 7.5,51.5 7,55 6,55 5.5,56 5.5,57 5.5,58 13.5,46.5 17.5,45.5 21,45.5 22.5,45.5 24.5,47 22,48.5 27,48.5 27,46.5 27,44.5 26,44.5 35.5,49.5 37,49.5 38.5,49.5 40,49.5 35.5,52 37,52 38.5,52 39.5,52 35.5,56 37,56 38.5,56 39.5,56 29.1,58.25 55.25,66 55.25,65 55.25,63.5 55.25,62.5 67.25,63.75 40.75,70.25 54.25,78.25 54.25,77.25 69.5,78.3 8,73 11,73 9.4,70 8,66 11,66 19,69 19,72 22,72 28.5,69.7 76,76 81,76 76,74 81,74 81,72 80,69 83.3,76.1 88,76 86,72 83.3,69.2 86,69 90,72 93,72 93,68 93,65 93,62 93,59 93,56 93,53 93,50 81.4,55.7 84,55 80,49 84,49 84,46 80,46 81,44 79,44 73,50 73,48 70.5,49 68,50 68,48 88,46 93,46 88,49 88,44 85,42 88,42 36.3,54 39,54 4,43 9,43 14,43 11,45 2,45 2,48 2,51 26,43 27,43 41.6,19.3 8.1,77.2 8.1,76.1 7.4,63 7.4,62 8.7,62.4 11,62.5 12.9,62.5 31.15,81.7 32.6,42.8 36,42.8 39.1,42.8 41.6,42.8 46.7,42.9 51.6,42.8 55.7,42.8 93.1,41.5 57.9,59.1 84,57.6 81.4,57.9 81.4,60.4 60.53,56.59 61.57,56.66 61.84,56 28.75,84.8 28.25,84.2 27.55,83.8 27.65,84.8 34,82.7 34,79 62.5,80.5 59.9,83.4 56.5,82.2 53.3,83.5 52,82.5 54.4,80.7 14.6,83.8 77.3,82 75.6,80.8 75.3,84.6 70.9,84.8 71,81.2 13,71.9 17.6,71.9 17.6,67.3 13,67.3 15.3,71.9 13,69.7 17.6,69.7 15.3,67.3 15.3,69.7 59.33,55.82 61.35,55.49 64.9,72.32 38.4,67.5 38.4,65.8 40.3,65.8 40.3,67.5 26.98,54.4 27.1,52.1 27.7,54.4 21.2,55.3 20.4,55.3 28.5,71.4 22.9,66.1
  pour Bottom (hatched): 94,41 0.2,41.3 1,10 arc90 10,1 86,1 arc97 94,10
  pour Bottom (rank 6): 95.2,82 95.3,40.9 -0.3,41.3 0.6,83.1 arc-90 3.6,86.1 90.7,86.2 arc-90
  pour Top (rank 3, hatched): -0.9,41.3 95.8,41.1 95.8,-1 -0.9,-1
  pour Top (rank 6): -0.6,86.4 96.1,86.4 96.1,40.9 -1.1,40.9 -1.1,86.5
  pour Top (no thermals): 58.4,56.9 58.5,56.9 58.8,57.2 59.3,57.2 59.3,58.3 58.4,58.3 58.2,58.5 58.2,57.9 58.3,57.8 58.3,57
I2C_INT  (via drill 0.4)
  Top 0.2: v51.4,48.8 50.9,48.4 IC5.1
  Top 0.305: v33.7,56.6 30.3,60 28.8,61.5 26,61.5 24.3,63.2 24.2,63.2 22.4,63.2 21.4,62.2 20.1,62.2 19.04,61.14 IC3.10
  Bottom 0.305: v33.7,56.6 33.7,56.5 33.4,56.2 33.4,47.9 33.8,47.5 50.7,47.5 51.1,47.5 51.4,47.8 v51.4,48.8
I2C_SCL  (via drill 0.4)
  Top 0.2: IC5.13 53.7,46.6 v55.3,48.2
  Top 0.254: IC6.8 38.1,26.4 38.1,28.9 38.1,30.1 43,35 v43,48.7 | v55.3,48.2 55.3,55.75 X3.6 | 22.35,58.05 22.9,57.5 26.3,57.5
  Top 0.305: IC3.12 21.68,58.27 R24.2 22.35,58.7 22.35,58.05 | v34.7,53.9 31.1,57.5 29.6,59 28.3,59 26.8,57.5 26.3,57.5 | v52.1,59.8 52.4,59.8 53.9,58.3 53.9,57.25 X3.6
  Bottom 0.305: v34.7,53.9 34.4,53.6 34.4,48.9 34.8,48.5 41.3,48.5 41.7,48.9 42.8,48.9 v43,48.7 43.2,48.5 49.5,48.5 50.2,49.2 50.2,49.3 50.9,50 51.9,50 52.6,49.3 52.6,49.1 52.9,48.8 54.5,48.8 54.7,48.8 v55.3,48.2 | TP114.P$1 49.2,59.8 v52.1,59.8
I2C_SDA  (via drill 0.4)
  Top 0.2: IC5.14 52.8,47 v53.9,48.1
  Top 0.254: IC6.9 37.6,26.2 37.6,28.6 37.6,30.2 42.5,35.1 42.5,47.7 v42,48.2 | v53.9,48.1 53.9,50.75 X3.7
  Top 0.305: IC3.11 R23.2 | R23.2 | R23.2 20.41,60.89 20.4,60.9 | v34.3,55.5 33.8,55.5 33.5,55.8 33,56.3 33,56.5 30.2,59.3 28.6,61 25.8,61 25.7,61 24,62.7 23.9,62.7 22.6,62.7 21.6,61.7 20.8,61.7 20.41,61.31 R23.2 | X3.7 53.85,50.85 52.6,52.1 52.6,58.6 v52.4,58.8
  Bottom 0.305: v34.3,55.5 34.2,55.5 33.9,55.2 33.9,48.4 34.3,48 41.7,48 | 41.7,48 45.9,48 49.7,48 50.7,49 50.7,49.1 51.1,49.5 51.7,49.5 52.1,49.1 52.1,48 52.5,47.6 53.4,47.6 v53.9,48.1 53.8,48 | v42,48.2 41.9,48.2 41.7,48 | TP115.P$1 46.5,60.2 47.9,58.8 52,58.8 | 52,58.8 v52.4,58.8 52,58.8
LCD_!RESET  (via drill 0.4)
  Top 0.305: X1.15 77.6,60.85 v77.6,60.9 | 8.98,75.12 v9,75.1 9,79.06 IC3.37
  Top 0.406: 8.88,75.22 v9,75.1
  Bottom 0.305: v9,75.1 10.6,75.1 11,75.5 17.3,75.5 17.5,75.7 20.3,75.7 20.5,75.5 22.3,75.5 22.8,75 25.4,75 25.9,75.5 29.8,75.5 32.2,73.1 32.4,72.9 32.4,72.5 32.4,47.3 33.2,46.5 74.8,46.5 75.3,47 75.3,57.4 75.1,57.6 75.1,59.8 76.2,60.9 v77.6,60.9 78,60.5 TP113.P$1
LCD_BUSY  (via drill 0.4)
  Top 0.305: 78.7,61.4 v78.4,61.7 78.75,61.35 X1.16 | 10.25,75.95 v10.2,76 | IC3.36 10.15,76.05
  Top 0.406: 10.15,76.05 v10.2,76
  Bottom 0.305: v10.2,76 17.1,76 17.3,76.2 20.5,76.2 20.7,76 22.5,76 23,75.5 25.2,75.5 25.7,76 30.1,76 32.9,73.2 32.9,47.6 33.5,47 74.4,47 74.8,47.4 74.8,57.2 74.6,57.4 74.6,60 76.3,61.7 v78.4,61.7 78.6,61.5 TP118.P$1
LCD_CS  (via drill 0.4)
  Top 0.305: v76.4,59.4 77.9,59.4 78.35,59.85 78.4,59.85 X1.13 | IC3.31 16.6,79.08 v16.6,74
  Bottom 0.305: v76.4,59.4 76.4,59.5 v76.4,59.4 | v76.4,59.4 76.1,59.1 76.1,58.1 76.3,57.9 76.3,46.6 75.2,45.5 32.8,45.5 31.4,46.9 31.4,72.3 29.2,74.5 26.3,74.5 25.8,74 22.4,74 21.9,74.5 20,74.5 19.8,74.7 18,74.7 17.5,74.2 16.8,74.2 v16.6,74 | TP109.P$1 78.6,58.9 78.3,59.2 76.7,59.2 v76.4,59.4
LCD_D/!S  (via drill 0.4)
  Top 0.305: v77,60.1 77.9,60.1 78.15,60.35 78.2,60.35 X1.14 | IC3.33 14.06,79.08 v14.06,74.74
  Bottom 0.305: v14.06,74.74 17.24,74.74 17.7,75.2 20.1,75.2 20.3,75 22.1,75 22.6,74.5 25.6,74.5 26.1,75 29.5,75 31.9,72.6 31.9,47.1 33,46 75,46 75.8,46.8 75.8,57.6 75.6,57.8 75.6,59.6 76.1,60.1 v77,60.1 77.3,59.8 79.2,59.8 79.5,59.5 TP111.P$1
LCD_MOSI  (via drill 0.4)
  Top 0.305: v77.6,58 77.8,58.1 78.4,58.1 79.15,58.85 79.2,58.85 X1.11 | 19.14,73.56 v19.2,73.5 19.2,79.02 IC3.29
  Bottom 0.305: v77.6,58 77.6,56.5 | 77.6,56.5 77.6,46.4 75.7,44.5 32.4,44.5 30.4,46.5 30.4,71.7 28.6,73.5 26.8,73.5 26.3,73 22.1,73 22,73 21.5,73.5 v19.2,73.5 | TP107.P$1 77.6,56.5
LCD_SCK  (via drill 0.4)
  Top 0.305: v76.8,58.5 77,58.7 78.2,58.7 78.85,59.35 X1.12 | IC3.30 17.87,74.33 v18.3,74
  Bottom 0.305: v18.3,74 18.5,74.1 18.6,74.2 19.6,74.2 19.8,74 21.7,74 22.2,73.5 22.4,73.5 26,73.5 26.5,74 28.9,74 30.9,72 30.9,46.7 32.6,45 75.4,45 76.8,46.4 v76.8,58.5 77,58.7 78,58.7 78.3,58.4 78.3,58.1 78.9,57.5 TP108.P$1
N$1  (via drill 0.4)
  Top 0.254: IC6.10 33.1,30 18,30 v14,30
  Bottom 0.254: v14,30 TB104.P$1
N$2
  Bottom 0.305: D101.2 73.8,80.4
  Bottom 0.406: D100.4 77,83.6 73.8,80.4
N$3  (via drill 0.4)
  Top 0.305: v32,83.1 32.6,83.7 v34.1,83.7
  Bottom 0.305: D104.2 31.8,80.4 32,80.6 v32,83.1 | v34.1,83.7 34.1,83.6 D103.4
N$4
  Bottom 0.305: D105.2 17.78,80.2 18.5,80.2 18.7,80 19.2,80 23.8,80 24.2,80.4 24.2,81.1 24.6,81.5 24.9,81.5 25.42,82.02 D104.4
N$6  (via drill 0.4)  (1 unrouted)
  Top 0.305: X2.8 arc45 5.45,53.4 v7.1,53.4 | v16.6,57.3 16.61,57.29 arc45 16.66,57.3 17.9,57.3
  Bottom 0.305: v7.1,53.4 12.8,53.4 arc45 13.14,53.54 16.5,56.9 arc45 16.6,57.14 v16.6,57.3
N$8
  Top 0.305: IC1.9 44.4,74.4 43.8,73.8 R13.2
N$10
  Top 0.254: IC1.24 51,72.9 51.3,72.5 51.3,71.7 49.4,69.8 49,69.3 R15.1
  Top 0.406: R15.1 48,68.5 47,67.5 Q3.2
N$11  (via drill 0.4 pad 0.81)
  Top 0.254: Q4.2 49.5,67 49.8,67.3 49.8,69.3 50.2,69.7 v50.3,69.7 | IC1.28 50.9,74.9 v51.6,75.4
  Top 0.406: R18.1 48.1,65.7 48.9,66.5 Q4.2
  Bottom 0.254: v51.6,75.4 52.5,74.8 52.5,72.7 51,71.2 51,70.3 v50.3,69.7
N$13
  Top 0.406: Q4.1 50.8,68.2 R15.2
N$14
  Top 0.406: Q3.1 45.1,66.3 R18.2
N$15
  Top 0.254: Q6.1 21.95,52.65 22.5,52.1 23.75,52.1 R27.2
  Top 0.305: 23.7,52.05 R27.2
N$16
  Top 0.61: U$1.- 83.13,78.2 73.6,78.2 73,78.8 Q2.3
N$17
  Top 0.254: T3.1 21,51.55 Q6.3 20.4,52 18.65,53.75 R28.1
N$18
  Top 0.61: R2.1 81.2,79.6 83.1,81.5 84.94,81.5 U$1.+
N$19
  Bottom 0.305: D102.2 57.78,81.6 60.5,81.6 62.5,83.6 D101.4
N$22
  Top 0.406: D8.C D7.A 67.1,57.7 67.1,58.5 arc-90 C25.1
N$23
  Top 0.406: C25.2 69.2,58.9 71,58.9 | Q5.3 71.4,63.6 72.3,62.7 72.3,61.5 L1.2 71,60 71,58.9 | 71,58.9 D9.A
N$25  (via drill 0.4)
  Top 0.254: IC6.20 43.74,22.76 44,23 45,23 49,27 53,31 59.3,37.3 63.3,37.3 65,39 66,40 81,40 87,34 87,32 v86,31
  Bottom 0.254: v86,31 86,22 87,21 89.6,21 TB102.L
N$26
  Top 0.254: 42.2,73.3 R12.1
  Top 0.305: D6.A 42.2,73.3
N$27
  Top 0.254: D4.A 54.6,76.1 R3.1
N$28
  Top 0.254: D5.A 54.6,71.1 R14.1
N$32  (via drill 0.4)
  Top 0.406: USB1.1 48.8,80.1 49.7,79.2 F1.1 50.4,79.7 50.4,80.1 51,80.1 51.5,80.5 v51.5,81.7
  Bottom 0.406: TP139.P$1 51.2,81.5 v51.5,81.7
N$42
  Top 0.406: IC3.4 11.5,59.5 12.3,58.6 12.3,58 arc-90 C28.2
N$43
  Top 0.305: C29.2 13.7,58.45 13.7,58.9 12.69,59.91 IC3.5
N$45
  Top 0.305: R11.1 70.65,75 Q2.1
N$46
  Top 0.305: IC4.6 59.1,53.1 58.6,52.6 R29.2
N$47
  Top 0.305: IC4.8 60.1,52.3 R30.2
N$48
  Top 0.305: R30.1 60.3,48.8 R32.2 60.3,48.65 60.3,47 61.9,45.4 X4.1
N$49
  Top 0.305: IC4.9 60.6,54.2 60.8,54.4 60.9,54.5 | IC4.10 61.1,54.3 61.3,54.5
  Top 0.61: 60.9,54.5 61.3,54.5 63.1,54.5 63.15,54.45 C34.1
  Top 1.016: X4.3 62.2,49.5 62,49.7 62,52.5 61.5,53 | F2.1 58.1,54.3 58.6,54.8 60.6,54.8 60.9,54.5
  pour Top (rank 2, no thermals): 61.3,54.6 60.8,54.6 60.6,54.3 60.6,53.2 60.8,53 61,53 61.7,52.3 61.8,52.3 62.2,52.7 61.5,53.4 61.5,54.4
N$50
  Bottom 0.305: D103.2 45.3,80.4 48.5,83.6 D102.4
N$52
  Top 0.305: R10.2 66.75,75 Q1.1
N$53  (via drill 0.4)
  Top 0.305: 62.85,75.1 R9.1 62.7,75.35 62.7,77.5 63.1,77.9 v63.6,77.9 64.3,77.9 64.5,78.1 64.5,78.75 T2.1 | v67.7,77.8 Q1.3
  Bottom 0.305: v67.7,77.8 63.7,77.8 v63.6,77.9
N$55  (via drill 0.4)
  Top 0.254: IC6.19 42.54,22 47,22 54,29 59,34 v63,34
  Bottom 0.254: v63,34 65,36 74,36 73,37 TB102.UP
N$56  (via drill 0.4)
  Top 0.254: IC6.18 42.7,21.1 v56.4,21.1
  Bottom 0.254: v56.4,21.1 57,21.66 57,22.04 57,21.04 56.9,21.1 v56.4,21.1
  Bottom 0.305: TB102.R 56.4,21.44 57,22.04
N$57  (via drill 0.4)
  Top 0.254: IC6.17 46.2,16.9 48.1,16.9 57,8 v63,8
  Bottom 0.254: v63,8 65,6 73,6 TB102.D
N$58  (via drill 0.4)
  Top 0.254: IC6.13 38.2,21 v24,21
  Bottom 0.254: v24,21 21,18 20,18
  Bottom 0.406: TB103.P$1 20,18
N$59
  Top 0.2: IC5.10 50.1,45.85 R33.2
N$61  (via drill 0.4)
  Top 0.305: IC6.5 41.8,25.3 41.8,26.1 40.8,27.1 40.8,28.3 TP100.P$1 v41.5,29.8 41.5,30.6 41.9,31 R34.1
  Bottom 0.305: v41.5,29.8 TP100.P$1
N$62  (via drill 0.4)
  Top 0.305: IC6.6 41.2,25.4 41.2,25.8 39.5,27.5 v39.5,28.2 | v39.5,28.2 TP101.P$1 v39.5,28.2
  Bottom 0.305: TP101.P$1 v39.5,28.2
N$64  (via drill 0.4)
  Top 0.254: IC6.14 38,20.1 38,12 v35,9
  Bottom 0.254: v35,9 33.9,7.9 TB101.P$1
N$65  (via drill 0.4)
  Top 0.254: IC6.15 40,21.33 40,20 40,18 41,17 45,13 v45,12
  Bottom 0.254: v45,12 47,10 47,8
  Bottom 0.305: 47,8 | 47,8 TB100.P$1
PREVGH  (via drill 0.4)
  Top 0.254: C32.2 73.85,55.65 74.3,55.2 77.8,55.2 77.95,55.35 X1.4
  Top 0.305: v71.5,56 D9.C
  Top 0.406: D9.C 71.3,55.65 C32.2
  Bottom 0.305: TP104.P$1 v71.5,56
PREVGL  (via drill 0.4)
  Top 0.254: D8.A 69.1,54.1 C36.2 69.6,54 70.2,53.4 74.5,53.4 77.9,53.4 78.85,54.35 X1.2
  Top 0.305: v69.7,56 D8.A
  Bottom 0.305: TP105.P$1 v69.7,56
PROXIMITY  (via drill 0.4)
  Top 0.254: IC6.2 44.7,26 45,26 46,27 52,33 53,34 55,36 v55,38.3
  Bottom 1.016: 53,38.3 v55,38.3
  Bottom 2.5: 10.2,1.9 44.2,1.9 | 10.2,1.9 arc-90 1.9,10.2 1.9,32.3 arc-90 7.8,38.3 13,38.3 53,38.3 | 44.2,1.9 84.6,1.9 arc90 93.1,9.9 93.1,37 | 10.2,1.9 44.2,1.9
  Bottom 2.54: v55,38.3 53,38.3
RESE  (via drill 0.4)
  Top 0.305: v77.2,65.1 77.8,65.1 78.5,64.4 78.55,64.35 X1.22 | v77.2,65.1 77,65.1 | 77,65.1 71.2,65.1 70.8,65.4 70.8,66 Q5.2 | v77.2,65.1 77,65.1
  Top 0.406: R19.1 68.8,66.1 68.8,65.9 70.4,65.9 Q5.2
  Bottom 0.305: TP123.P$1 76.1,65.1 v77.2,65.1
SD1  (via drill 0.4)
  Top 0.406: IC3.22 27,73 v27.5,72.5
  Bottom 0.305: TP132.P$1 27,72 v27.5,72.5
SD2  (via drill 0.4)
  Top 0.406: IC3.17 26.65,66.65 v27.5,67.5
  Bottom 0.305: v27.5,67.5 27,67 TP126.P$1
SD3  (via drill 0.4)
  Top 0.406: IC3.18 26.82,67.92 v27.5,68.5
  Bottom 0.305: v27.5,68.5 27,68 TP127.P$1
SD_CD  (via drill 0.4)
  Top 0.2: IC5.6 46.5,47.4 44.8,45.8 v44.8,43.7
  Top 0.305: X2.CD1 15.6,49.9 16.75,48.75 R31.2 17.95,48.7 v18.9,48.7 | v30.4,45.4 25.7,45.4 24,43.7 18.4,43.7 v18.3,43.6
  Bottom 0.305: v44.8,43.7 44.5,44 31.8,44 v30.4,45.4 | v18.3,43.6 18.3,48.1 v18.9,48.7
SD_CLK  (via drill 0.4)
  Top 0.305: X2.5 10.48,50.16 arc-45 10.93,49.97 v11.4,49.5 | v22.9,62 22.9,60.53 IC3.13 22.9,60.43 22.9,59.5 23.6,58.8 R25.1
  Bottom 0.305: v11.4,49.5 12.44,49.5 arc45 12.89,49.69 20.31,57.11 arc-45 20.53,57.2 | 20.53,57.2 21.2,57.2 | 20.53,57.2 21.4,57.2 21.88,57.2 arc90 22.2,57.52 22.2,57.53 22.2,57.78 arc90 21.88,58.1 20.52,58.1 arc-90 20.2,58.42 20.2,58.48 arc-90 20.52,58.8 21.88,58.8 arc90 22.2,59.12 22.2,59.28 arc90 21.88,59.6 20.52,59.6 arc-90 20.2,59.92 20.2,60.08 arc-90 20.52,60.4 22.57,60.4 22.58,60.4 arc90 22.9,60.72 22.9,60.88 arc90 22.58,61.2 21.42,61.2 arc-90 21.1,61.52 21.1,61.68 arc-90 21.42,62 v22.9,62
SD_CMD  (via drill 0.4)
  Top 0.305: v7.3,48 5.4,48 arc45 X2.3 | v19.5,66 19.8,66 23.71,69.91 arc45 23.9,70.36 23.9,73.24 arc-45 24.09,73.69 24.48,74.08 arc-45 24.93,74.27 IC3.23 26.09,74.1 R8.1
  Bottom 0.305: v7.3,48 7.54,48 arc45 7.99,48.19 10.71,50.91 arc-45 11.16,51.1 12.44,51.1 arc45 12.89,51.29 18.51,56.91 arc45 18.7,57.36 18.7,64.6 18.7,65.1 v19.5,66
SD_DATA0  (via drill 0.4)
  Top 0.305: v19.5,67 20.1,67 23.21,70.11 arc45 23.4,70.56 23.4,74.34 arc-45 23.59,74.79 24.21,75.41 arc-45 24.66,75.6 25.86,75.6 IC3.24 26.08,75.7 R5.1 27.75,77 D2.A | v6.6,52.4 arc-45 6.5,52.36 X2.7
  Bottom 0.305: v19.5,67 17.9,65.4 17.9,57.56 arc-45 17.71,57.11 13.19,52.59 arc-45 12.74,52.4 v6.6,52.4
SD_DATA1  (via drill 0.4)
  Top 0.305: v19.5,68 20.3,68 22.71,70.41 arc45 22.9,70.86 22.9,76.5 22.9,79.13 IC3.26 22.8,79.23 22.8,79.7 22.9,79.5 23.1,79.9 23.4,80.2 25.7,80.2 26.2,80.7 26.6,80.7 R1.1 | SJ2.1 17.21,58.94 arc-45 v17.1,59.2
  Bottom 0.305: 17.1,59.6 v17.1,59.2 17.1,59.6 | 17.1,59.6 17.1,65.5 v19.5,68
SD_DATA2
  Top 0.305: SJ1.1 25.96,60 arc-45 25.51,60.19 25.39,60.31 arc45 24.94,60.5 24.14,60.5 IC3.14
SD_DATA2_OUT  (via drill 0.4)
  Top 0.305: 6.56,45.76 v6.7,45.8 | SJ1.2 27.81,59.57 arc-45 27.62,59.12 27.29,58.79 arc-45 26.84,58.6 25.55,58.6 R26.1 25.3,58.64 arc45 25.11,59.09 v25,59.2
  Top 0.813: 6.56,45.76 X2.1
  Bottom 0.305: v6.7,45.8 8.64,45.8 arc45 9.09,45.99 11.81,48.71 arc-45 12.26,48.9 12.54,48.9 arc45 12.99,49.09 13.38,49.48 arc-90 13.82,49.48 14.07,49.23 arc90 14.53,49.33 14.47,49.27 arc90 14.57,49.73 14.32,49.98 arc-90 14.32,50.42 14.36,50.46 arc-94 14.82,50.44 15.08,50.16 arc94 15.54,50.14 15.59,50.19 arc86 15.61,50.62 15.29,50.98 arc-86 15.31,51.41 15.38,51.48 arc-90 15.82,51.48 16.07,51.23 arc90 16.52,51.23 16.57,51.27 arc90 16.57,51.73 16.32,51.98 arc-90 16.32,52.42 16.38,52.48 arc-90 16.82,52.48 17.07,52.23 arc90 17.52,52.23 17.57,52.27 arc90 17.57,52.73 17.32,52.98 arc-90 17.32,53.42 17.38,53.48 arc-90 17.82,53.48 18.07,53.23 arc90 18.52,53.23 18.57,53.27 arc90 18.57,53.73 18.32,53.98 arc-90 18.32,54.42 18.38,54.48 19.32,55.42 20.21,56.31 arc-45 20.43,56.4 22.57,56.4 arc45 22.79,56.49 23.31,57.01 24.81,58.51 arc45 25,58.96 v25,59.2
SD_DATA3  (via drill 0.4)
  Top 0.305: v7.34,47 6.04,47 arc-90 5.9,46.86 X2.2 | v19.5,65 19.6,65 20.18,65.58 arc-90 20.62,65.58 20.77,65.42 arc90 21.23,65.42 21.27,65.47 arc90 21.27,65.92 21.12,66.08 arc-90 21.12,66.53 21.27,66.67 arc-90 21.73,66.67 21.88,66.53 arc90 22.43,66.62 22.38,66.58 arc90 22.48,67.12 22.3,67.3 arc-115 22.31,67.71 22.51,67.91 arc-45 22.73,68 23.98,68 arc-90 24.3,67.68 24.3,65.72 arc90 24.62,65.4 24.8,65.4 IC3.16 26.68,65.38 27.4,66.1 28.05,66.1 R17.1
  Bottom 0.305: v19.5,65 19.5,57.36 arc-45 19.31,56.91 13.09,50.69 arc-45 12.64,50.5 11.36,50.5 arc45 10.91,50.31 7.79,47.19 arc-45 v7.34,47
TOUCH_INT
  Top 0.2: IC5.7 46.8,47 45.5,45.7 45.5,43.3 45.2,43 44,43 43.5,42.5
  Top 0.254: IC6.7 38.6,26.6 38.6,29 38.6,29.9 43.5,34.8 43.5,42.5
USB_DN_CON  (via drill 0.4)
  Top 0.305: IC1.5 47.3,77.7 v46.9,78.1 | v48.3,79.3 48.2,79.6 USB1.2
  Bottom 0.305: v46.9,78.1 47,78.2 48.2,79.3 v48.3,79.3
  Bottom 0.406: TP137.P$1 48.3,79.9 v48.3,79.3
USB_DP_CON  (via drill 0.4)
  Top 0.305: USB1.3 47.5,79.5 | 47.5,79.5 47.5,78.8 47.8,78.6 IC1.4 | v46.9,79.5 47.3,79.5 47.5,79.5
  Bottom 0.406: TP138.P$1 47,79.6 v46.9,79.5
VBAT  (via drill 0.4)
  Top 0.305: R21.2 56.2,61.7 56.3,61.6 | v56.2,59 56.4,59 56.8,59.4
  Top 0.813: F2.2 57.04,57.1 arc-45 56.8,57.2 56.8,59.4 56.8,60.8 56.3,61.3 56.3,61.4 56.3,61.6 56.3,72.3 55.8,72.8 55.8,76 55.8,77.5 55.8,78.1 56.9,79.2 59.5,79.2 T1.3
  Bottom 0.305: 56.8,59 TP110.P$1 56.8,59 | 56.8,59 v56.2,59
VBAT_SENSE  (via drill 0.4)
  Top 0.305: C16.1 R20.2 R21.1 52.25,61.6 51.4,61.6 50.3,62.7 35.6,62.7 35.5,62.8 34.8,63.5 34.4,63.9 v29.2,63.9 | IC3.7 15.23,62.13 16,62.9 16.4,63.3 20.1,63.3 20.5,63.3 20.8,63.6 v21.7,63.6
  Bottom 0.305: v21.7,63.6 21.9,63.4 28.7,63.4 v29.2,63.9
VCC  (via drill 0.4)
  Top 0.61: IC2.2 65.3,68.1 65.5,68.1 IC2.2@ | R9.2 62.95,73.25
  Top 0.813: R2.2 73.8,79.6 73.4,80 65,80 63.85,80 T2.2 62.1,78.8 61.5,78.2 60.85,77.55 T1.2 61.05,76.5 D3.C 61.05,74.35 62.1,73.3 62.95,73.3 R9.2
  Top 1.016: R9.2 63,72.1 64.2,70.9 65.3,69.8 65.3,68.1 | 65.5,68.1 IC2.2 62.3,68.1 61.65,67.45 C15.1 | C15.1 60.8,67.55 C14.1 | C15.1 C18.1
  other vias: 65.3,71 65.3,69.7 65.3,66.6 66.6,66.6 68.3,71 68.3,69 71.3,70 70.3,71 70.3,69 72.3,69 69.3,70 72.3,71 73.3,70 74.3,71 74.3,69 75.3,70 76.3,71 76.3,69 75.3,68 73.3,68 71.3,68 69.3,68 67.3,70 66.3,71 66.3,69.7
  pour Top (no thermals): 66.7,66.1 68.1,67.5 69.7,67.5 70.2,67 75.8,67 77.3,68.5 77.3,70.7 76.5,71.6 63.7,71.6 63.4,71.1 64.2,70.3 64.2,66.8 64.9,66.1
  pour Bottom: 64.2,71.3 64.2,65.5 65,64.7 73.5,64.7 77.4,68.6 77.4,70.6 76.1,71.9 65.7,71.9 65.3,71.5 64.4,71.5
VCOM
  Top 0.254: C38.2 77.9,52.5 79.25,53.85 X1.1
VDD  (via drill 0.4, 0.4 pad 0.61)
  Top 0.305: R12.2 42.2,71.6 | 42.2,71.6 v43,71.6 | v43,71.6 R13.1 | R14.2 v51.8,71.1 | v51.6,76.7 R3.2 | C8.1 45.7,77.3 | 45.7,77.3 46.3,77.3 | 46.3,77.3 46.8,76.8 | 46.8,76.8 IC1.6 46.8,76.8 | v43,71.6 42.2,71.6 | 46.8,76.8 46.3,77.3 | 46.3,77.3 45.7,77.3 | 45.7,77.3 45.6,77.3 v45.6,76.7
  Bottom 0.305: v51.8,71.1 52,71.1 53,72.1 53,75.5 v51.6,76.7 50.8,75.9 50.8,74.2 50.5,73.9 50.5,73 50.1,72.6 46.8,69.3 44.5,69.3 43,70.8 v43,71.6 43,74.9 44.7,76.7 45.5,76.7 v45.6,76.7
VGH
  Top 0.305: X1.20 78.95,63.35 77.8,62.2 C21.2
VGL
  Top 0.254: 76.9,63.9 C19.2
  Top 0.305: X1.21 77.2,63.85 C19.2
VIBRATOR  (via drill 0.4)
  Top 0.2: v50.5,43.3 IC5.11
  Top 0.305: R11.2 71.75,73.25 72.3,72.7 76.9,72.7 78.4,71.2 78.4,68.2 v80.1,66.5 | v84.9,63.8 84.9,61.4 v83.5,60
  Bottom 0.305: v80.1,66.5 80.1,64.8 80.6,64.3 84.4,64.3 v84.9,63.8 | v50.5,43.3 50.7,43.5 76.1,43.5 76.2,43.6 76.3,43.7 78.6,46 78.6,51.4 78.6,52.1 79.1,52.6 79.2,52.7 79.6,52.7 80.3,52.7 82.6,55 82.6,59.1 v83.5,60
VSH
  Top 0.254: 77.3,55.9 C33.2 77.3,55.85 X1.5
VSL
  Top 0.254: C35.2 77.2,54.4 78.1,54.4 78.55,54.85 X1.3
VUSB_SENSE  (via drill 0.4)
  Top 0.305: IC3.6 13.96,61.66 16.1,63.8 20.1,63.8 20.6,64.3 v22.3,64.3 | R6.2 39.7,74.65 39.7,74 39.6,74 38.3,72.7 33.5,72.7 31.3,70.5 v29.1,70.5
  Top 0.406: R7.1 R6.2 C10.1
  Bottom 0.305: v22.3,64.3 22.4,64.3 22.8,63.9 28.3,63.9 28.9,64.6 28.9,65.9 29.4,66.5 29.4,70.2 arc90 v29.1,70.5
WS2812_DATA  (via drill 0.4)
  Top 0.406: v16.3,62.1 16.5,61.9 IC3.8
  Bottom 0.305: TP136.P$1 8,78.5 7.2,78.5
  Bottom 0.406: D105.4 9.1,83.6 8.6,83.1 8.6,81.8 7.2,80.4 7.2,78.5 7.2,64.5 8.4,63.3 15.1,63.3 v16.3,62.1
WS2812_DATA_OUT  (via drill 0.4)
  Top 0.305: v85.7,63.2 85.7,60.7 v84.2,59.2 | v57.1,42.8 v57.1,48.2 | v52.5,50.5 52.2,50.8 X3.8
  Bottom 0.305: v85.7,63.2 85.7,64.1 85.6,64.2 85,64.8 81,64.8 80.7,65.1 80.7,66 82.08,67.38 82.58,67.88 D100.2 | v57.1,42.8 57.3,43 76.3,43 79.1,45.8 79.1,51.5 79.1,51.7 79.2,51.8 79.6,52.2 80.5,52.2 83.1,54.8 83.1,58.1 v84.2,59.2 | v57.1,48.2 55.8,49.3 53.3,49.3 53.1,49.5 53.1,49.6 53.1,49.9 v52.5,50.5
WS2812_POWER  (via drill 0.4, 0.5)
  Top 0.305: 64.75,75 64.75,75.3 | C6.2 80.75,83.15 v80.6,83.6 | C2.2 16.25,82.85 v16.9,83.6 | C1.2 29.2,82.55 v29.2,83.6 | C4.2 41.75,82.95 v42.3,83.5 | C5.2 54.95,83.25 v55.2,83.5 | 68.05,83.45 v68.2,83.6
  Top 0.406: 64.75,75 64.75,75.3 C13.1 | C3.2 67.95,83.35 v68.2,83.6
  Top 0.813: v36.8,70.2 v34.8,68.2 | v43.5,58.9 43.69,58.71 X3.2 | v66.5,78.8 66.5,78.7 64.6,76.6 | 64.6,76.6 T2.3 | 64.75,75.3 64.75,75.35 64.6,75.5 64.6,76.6
  Bottom 0.305: v80.6,83.6 81.5,83.6 | v16.9,83.6 17.5,83.6 D105.1 | TP117.P$1 41.1,60.5 40.9,60.7 40.3,60.7 39.8,60.2 39.8,58.9 | v29.2,83.6 D104.1 | v42.3,83.5 43.48,83.5 D103.1 | v55.2,83.5 56.48,83.5 D102.1 | v68.2,83.6 D101.1
  Bottom 0.813: D100.1 81.5,83.6 v80.6,83.6 79.4,82.4 79.4,79.6 79.1,79.3 68.1,79.3 | 17.5,83.6 v16.9,83.6 15.9,82.6 15.9,79.7 16.4,79.2 24.7,79.2 26.7,79.2 29.9,82.3 30.58,82.98 D104.1 | v36.8,70.2 36.3,70.7 36.3,74.9 33,78.2 33,83.7 33,84.8 | v34.8,68.2 34.9,68.1 34.9,63.6 35.9,62.6 35.9,61.7 35.4,61.1 35.4,59.5 36,58.9 39.8,58.9 v43.5,58.9 | D101.1 69.5,83.52 69.5,82.6 68.1,81.2 68.1,79.4 68.1,79.3 | 68.1,79.3 67.6,78.8 v66.5,78.8
  Bottom 1.016: D101.1 69.5,83.68 69.5,84.8 56.5,84.8 | 56.5,84.8 52,84.8 43.5,84.8 | 43.5,84.8 33,84.8 31.4,84.8 30.58,83.98 D104.1 | D102.1 56.5,83.68 56.5,84.8 | D103.1 43.5,83.68 43.5,84.8
WS2812_POWER_EN  (via drill 0.4)
  Top 0.2: v46.2,43.7 46.2,45.7 46.8,46.3 47.1,46.6 IC5.8
  Top 0.305: R10.1 66.8,72.7 67.3,72.2 76.6,72.2 77.9,70.9 77.9,67.5 v79.1,66.3 | v84.1,63.2 84.1,62 v82.9,60.8 | v30.4,44.3 v28.2,44.3 | v24.7,54 23.95,54 R27.1
  Bottom 0.305: v79.1,66.3 79.1,64.5 79.8,63.8 83.5,63.8 v84.1,63.2 | v30.4,44.3 31.2,43.5 44,43.5 44.6,42.9 45.4,42.9 v46.2,43.7 46.5,44 75.6,44 75.8,44 75.9,44 78.1,46.2 78.1,52 78.1,52.4 78.9,53.2 80,53.2 82.1,55.3 82.1,60 v82.9,60.8 | v28.2,44.3 28.2,44.7 28.4,44.9 28.4,49.8 28.1,50.1 27.9,50.1 27.5,50.4 27.5,51.2 27.9,51.6 27.9,52 27.9,53.4 27.6,53.7 25.2,53.7 24.9,54 v24.7,54

## Text on the board
Top: MB
tPlace: RX | - | + | USB | TX
bPlace: GND | GND | VUSB_IN | ESP32_TX | ESP32_RX | WS2812_DATA | SD1 | USB_DP_CON | USB_DN_CON | CD0 | CLK | VCC | CND | SD3 | SD2 | GND | GDR | RESE | WS2812_POWER | GND | 3V3_SWITCHED | ESP32_!RESET | I2C_SDA | ESP32_FLASH | I2C_SCL | +3V3 | 5V | VBAT | LCD_BUSY | LCD_!RESET | LCD_D/!S | LCD_CS | LCD_SCK | PREVGL | GND | PREVGH | LCD_MOSI | GND | Warning Radiation | Do not Touch
tNames: Reset | Flash | Brought to / you by: | MarkusBec / Kartoffel / the_JinX / tsd / Roosted / Sprite_tm / Underhand | https://sha2017.org/
bNames: A | B | Start | Select